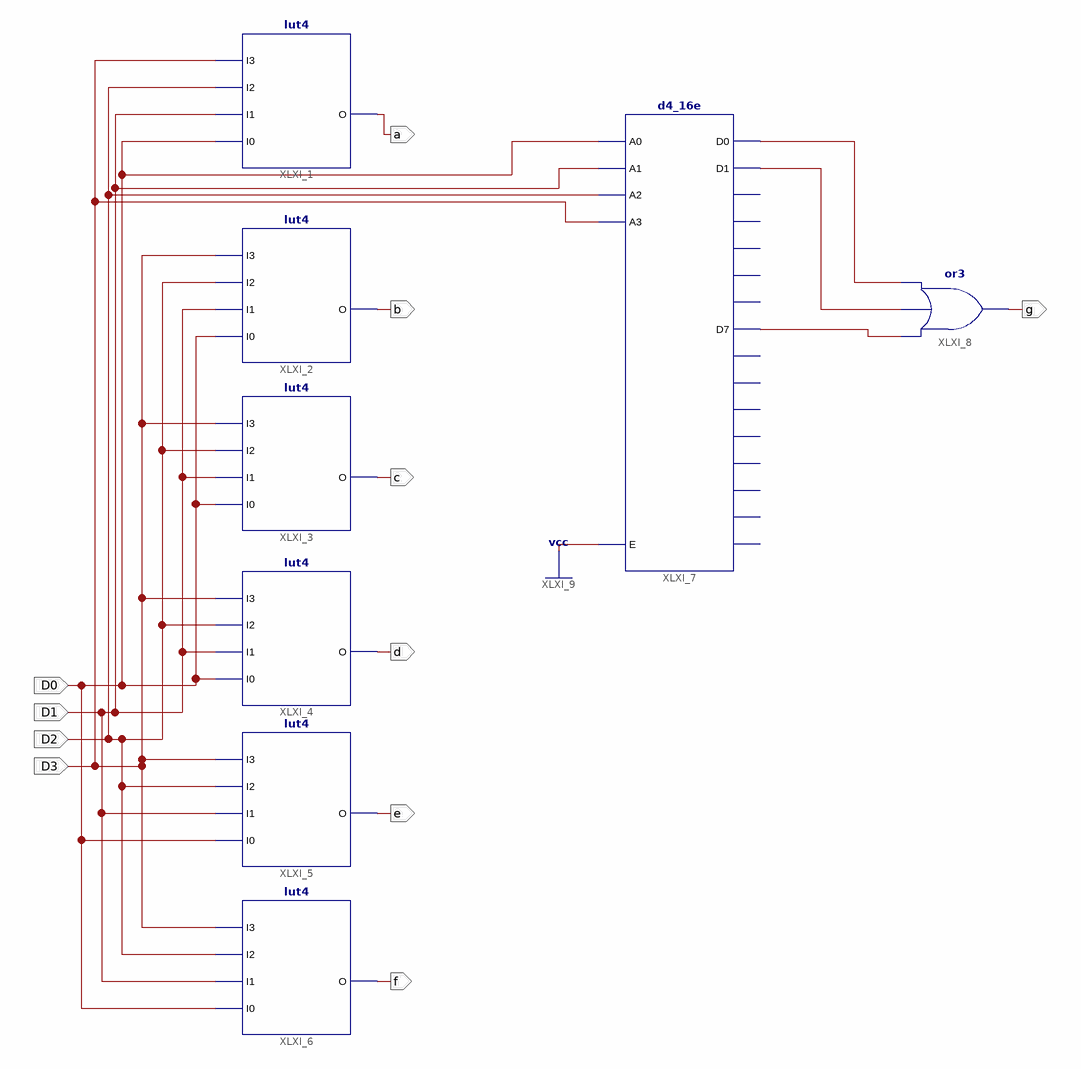
[diagram p0: schematic sheet 1]
// Xilinx ISE schematic ECE281_Lab1_Celiano_sseg_decoder.sch (spartan3e) as structural Verilog: 8 symbols, 11 ports
module ECE281_Lab1_Celiano_sseg_decoder (
  input  D3,
  input  D2,
  input  D1,
  input  D0,
  output a,
  output b,
  output c,
  output d,
  output e,
  output f,
  output g
);

  wire XLXN_21, XLXN_23, XLXN_24;

  lut4 #(.INIT("3812")) XLXI_1 (.I0(D0), .I1(D1), .I2(D2), .I3(D3), .O(a));
  lut4 #(.INIT("D860")) XLXI_2 (.I0(D0), .I1(D1), .I2(D2), .I3(D3), .O(b));
  lut4 #(.INIT("D004")) XLXI_3 (.I0(D0), .I1(D1), .I2(D2), .I3(D3), .O(c));
  lut4 #(.INIT("8692")) XLXI_4 (.I0(D0), .I1(D1), .I2(D2), .I3(D3), .O(d));
  lut4 #(.INIT("02BA")) XLXI_5 (.I0(D0), .I1(D1), .I2(D2), .I3(D3), .O(e));
  lut4 #(.INIT("308E")) XLXI_6 (.I0(D0), .I1(D1), .I2(D2), .I3(D3), .O(f));
  d4_16e XLXI_7 (
    .A0(D0), .A1(D1), .A2(D2), .A3(D3), .E(1'b1), .D0(XLXN_23), .D1(XLXN_24), .D7(XLXN_21));  // open: D10, D11, D12, D13, D14, D15, D2, D3, D4, D5, D6, D8, D9
  or XLXI_8 (g, XLXN_21, XLXN_24, XLXN_23);
endmodule
